# EAGLE design schem_interface_v2 (EAGLE 9.6.2)
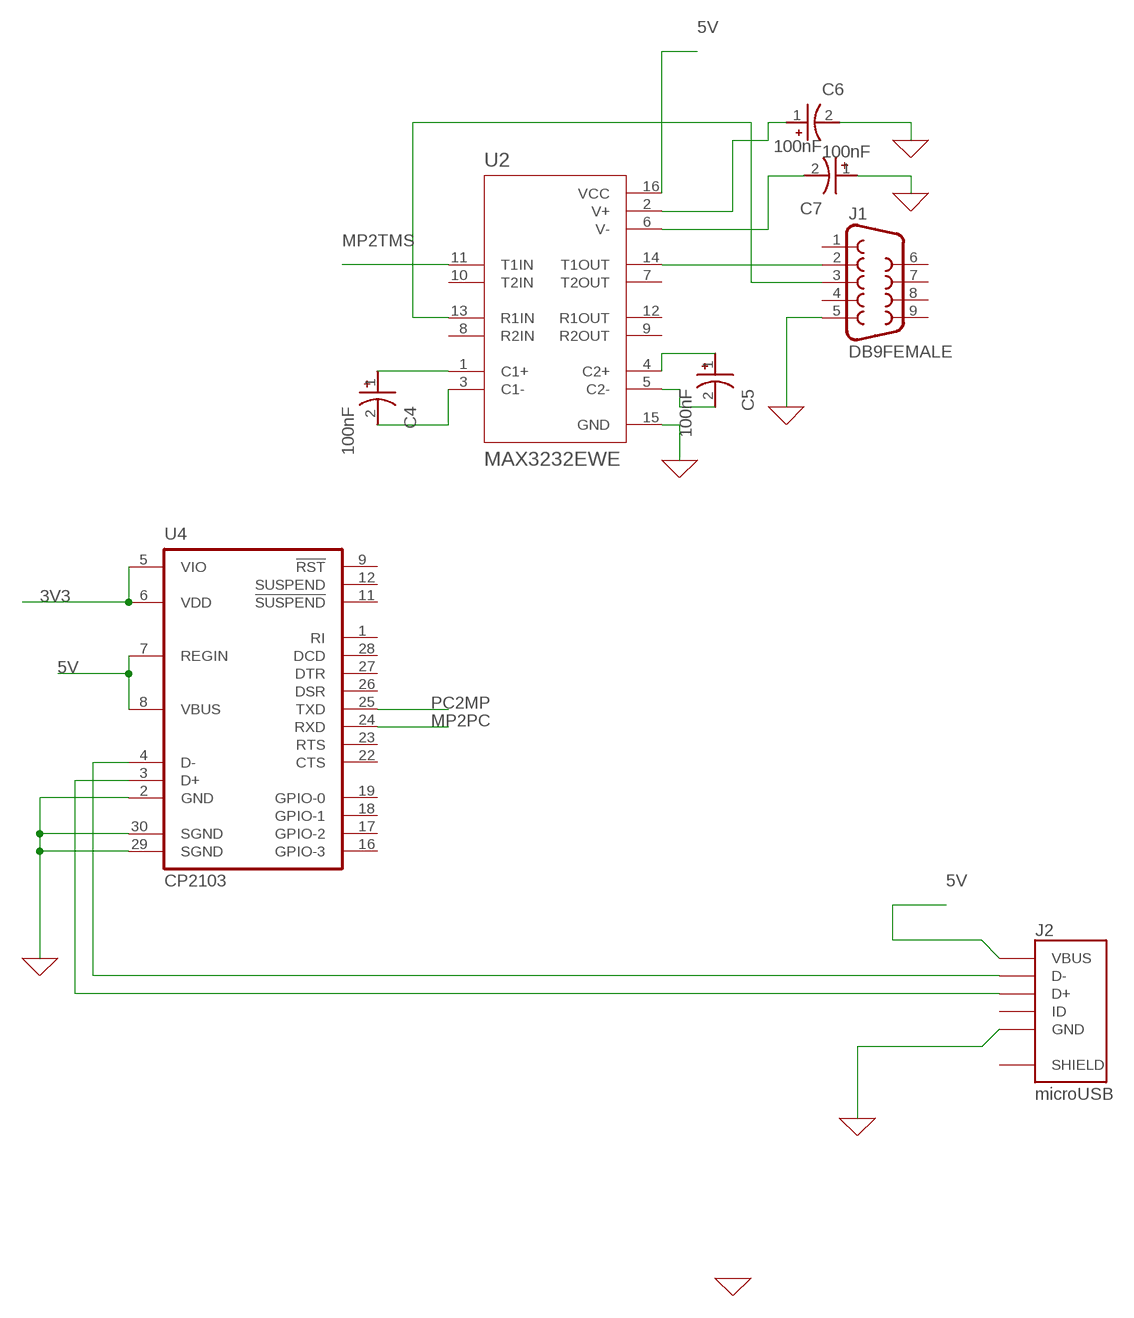
[diagram p0: schematic, sheet 1, part 1 of 2]
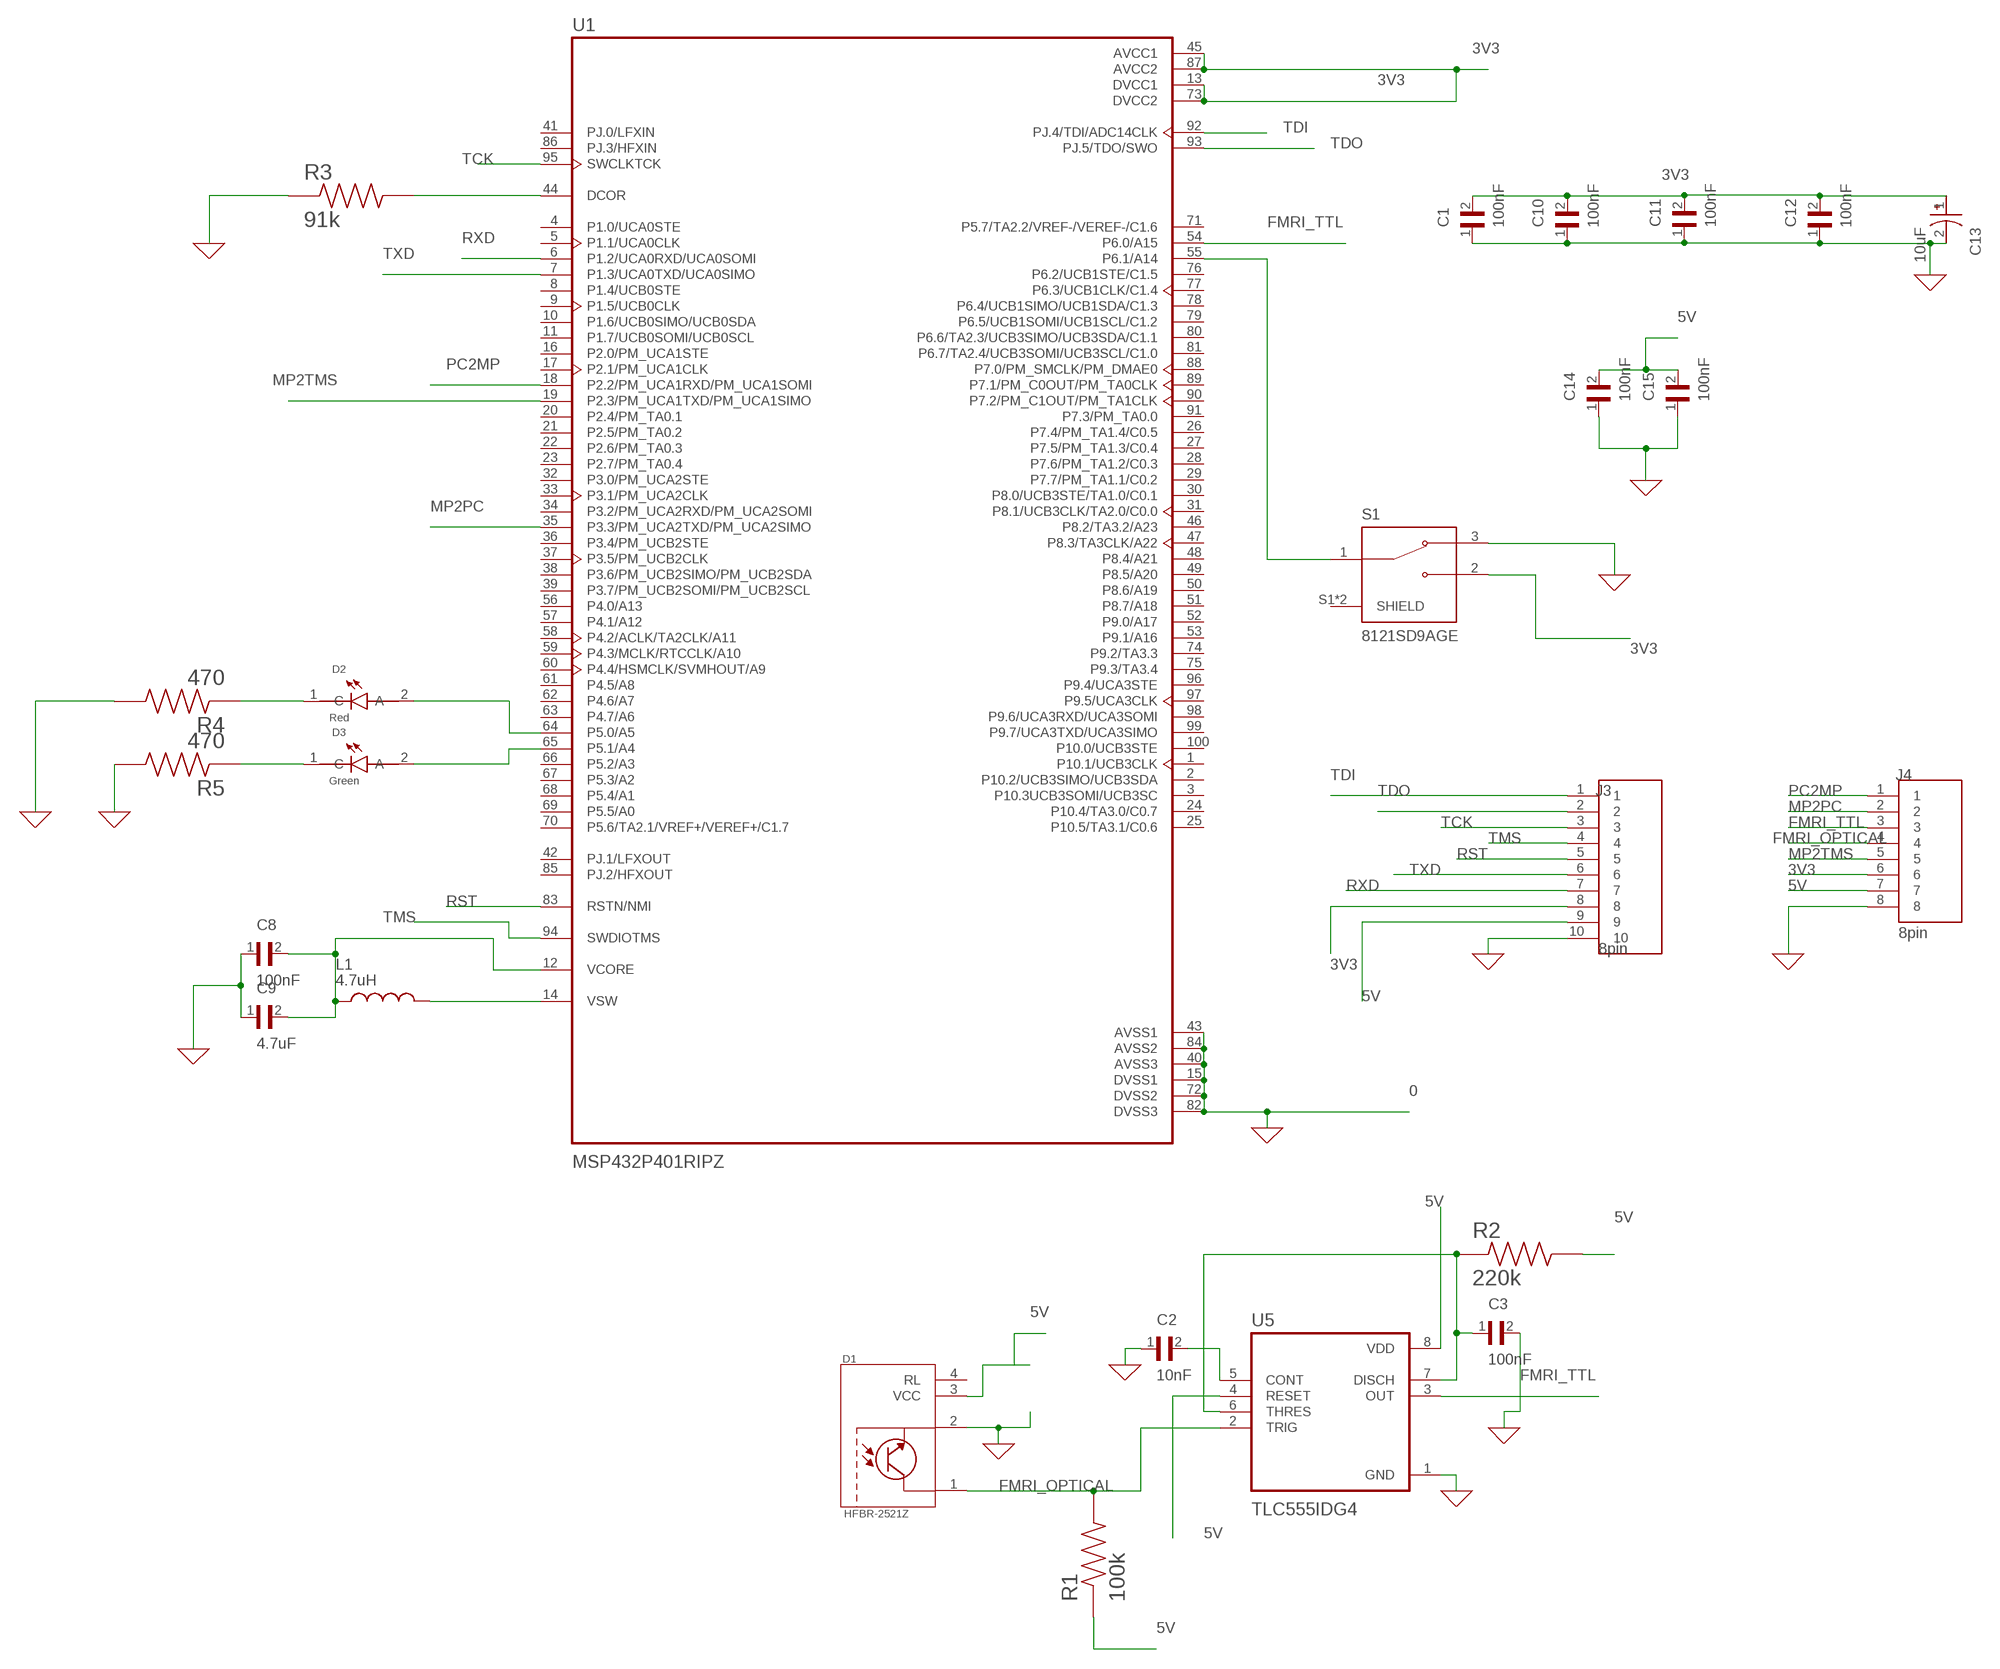
[diagram p1: schematic, sheet 1, part 2 of 2]

## Parts
C1  100nF  LD06ZC225KAB2A\500  [CAPC3216X178N]
C2  10nF  LD06ZC225KAB2A\500  [CAPC3216X178N]
C3  100nF  LD06ZC225KAB2A\500  [CAPC3216X178N]
C4  100nF  T491A106K020AT  [CAPMP3216X180N]
C5  100nF  T491A106K020AT  [CAPMP3216X180N]
C6  100nF  T491A106K020AT  [CAPMP3216X180N]
C7  100nF  T491A106K020AT  [CAPMP3216X180N]
C8  100nF  LD06ZC225KAB2A\500  [CAPC3216X178N]
C9  4.7uF  LD06ZC225KAB2A\500  [CAPC3216X178N]
C10  100nF  LD06ZC225KAB2A\500  [CAPC3216X178N]
C11  100nF  LD06ZC225KAB2A\500  [CAPC3216X178N]
C12  100nF  LD06ZC225KAB2A\500  [CAPC3216X178N]
C13  10uF  T491A106K020AT  [CAPMP3216X180N]
C14  100nF  LD06ZC225KAB2A\500  [CAPC3216X178N]
C15  100nF  LD06ZC225KAB2A\500  [CAPC3216X178N]
D1  HFBR-2521Z  [OPTO_HFBR-2521Z]
D2  Red  598-8210-107F  [LEDC3216X110N]
D3  Green  598-8210-107F  [LEDC3216X110N]
J1  DB9FEMALE  [DB9]
J2  microUSB  USB3090-XX-X_REVE  [GCT_USB3090-XX-X_REVE]
J3  8pin  4-644456-0  [TE_4-644456-0]
J4  8pin  5-146282-8  [TE_5-146282-8]
L1  4.7uH  LQM21PN4R7NGRD  [INDC2012X100N]
R1  100k  352015KJT  [RESC6432X70N]
R2  220k  352015KJT  [RESC6432X70N]
R3  91k  352015KJT  [RESC6432X70N]
R4  470  352015KJT  [RESC6432X70N]
R5  470  352015KJT  [RESC6432X70N]
S1  8121SD9AGE  [SW_8121SD9AGE]
U1  MSP432P401RIPZ  [QFP50P1600X1600X160-100N]
U2  MAX3232EWE  [SOIC127P1032X265-16N]
U4  CP2103  [QFN28]
U5  TLC555IDG4  [SOIC127P599X175-8N]

## Nets
0: C1.1 C2.1 C3.2 C6.2 C7.1 C8.1 C9.1 C10.1 C11.1 C12.1 C13.2 C14.1 C15.1 D1.2(GROUND) J1.5 J2.5(GND) J3.10 J4.8 R3.1 R4.2 R5.2 S1.3 U1.15(DVSS1) U1.40(AVSS3) U1.43(AVSS1) U1.72(DVSS2) U1.82(DVSS3) U1.84(AVSS2) U2.15(GND) U4.2(GND) U4.29(SGND) U4.30(SGND) U5.1(GND) ; supply symbol labelled GND
3V3: C1.2 C10.2 C11.2 C12.2 C13.1 J3.8 J4.6 S1.2 U1.13(DVCC1) U1.45(AVCC1) U1.73(DVCC2) U1.87(AVCC2) U4.5(VIO) U4.6(VDD)
5V: C14.2 C15.2 D1.3(VCC) J2.1(VBUS) J3.9 J4.7 R1.1 R2.2 U2.16(VCC) U4.7(REGIN) U4.8(VBUS) U5.4(RESET) U5.8(VDD)
FMRI_OPTICAL: D1.1(VO) J4.4 R1.2 U5.2(TRIG)
FMRI_TTL: J4.3 U1.54(P6.0/A15) U5.3(OUT)
MP2PC: J4.2 U1.35(P3.3/PM_UCA2TXD/PM_UCA2SIMO) U4.24(RXD)
MP2TMS: J4.5 U1.19(P2.3/PM_UCA1TXD/PM_UCA1SIMO) U2.11(T1IN)
N$1: D2.1(C) R4.1
N$2: C2.2 U5.5(CONT)
N$3: C3.1 R2.1 U5.6(THRES) U5.7(DISCH)
N$6: J1.2 U2.14(T1OUT)
N$7: C6.1 U2.2(V+)
N$8: J1.3 U2.13(R1IN)
N$9: C7.2 U2.6(V-)
N$10: R3.2 U1.44(DCOR)
N$11: D2.2(A) U1.64(P5.0/A5)
N$12: C5.1 U2.4(C2+)
N$13: C5.2 U2.5(C2-)
N$14: C4.1 U2.1(C1+)
N$15: C4.2 U2.3(C1-)
N$16: L1.2 U1.14(VSW)
N$17: C8.2 C9.2 L1.1 U1.12(VCORE)
N$18: D3.2(A) U1.65(P5.1/A4)
N$19: D3.1(C) R5.1
N$20: J2.3(D+) U4.3(D+)
N$21: S1.1 U1.55(P6.1/A14)
N$22: J2.2(D-) U4.4(D-)
PC2MP: J4.1 U1.18(P2.2/PM_UCA1RXD/PM_UCA1SOMI) U4.25(TXD)
RST: J3.5 U1.83(RSTN/NMI)
RXD: J3.7 U1.6(P1.2/UCA0RXD/UCA0SOMI)
TCK: J3.3 U1.95(SWCLKTCK)
TDI: J3.1 U1.92(PJ.4/TDI/ADC14CLK)
TDO: J3.2 U1.93(PJ.5/TDO/SWO)
TMS: J3.4 U1.94(SWDIOTMS)
TXD: J3.6 U1.7(P1.3/UCA0TXD/UCA0SIMO)
Unconnected: D1.4(RL) J1.1 J1.4 J1.6 J1.7 J1.8 J1.9 J2.4(ID) S1.S1(SHIELD) S1.S2(SHIELD) U1.1(P10.1/UCB3CLK) U1.2(P10.2/UCB3SIMO/UCB3SDA) U1.3(P10.3UCB3SOMI/UCB3SC) U1.4(P1.0/UCA0STE) U1.5(P1.1/UCA0CLK) U1.8(P1.4/UCB0STE) U1.9(P1.5/UCB0CLK) U1.10(P1.6/UCB0SIMO/UCB0SDA) U1.11(P1.7/UCB0SOMI/UCB0SCL) U1.16(P2.0/PM_UCA1STE) U1.17(P2.1/PM_UCA1CLK) U1.20(P2.4/PM_TA0.1) U1.21(P2.5/PM_TA0.2) U1.22(P2.6/PM_TA0.3) U1.23(P2.7/PM_TA0.4) U1.24(P10.4/TA3.0/C0.7) U1.25(P10.5/TA3.1/C0.6) U1.26(P7.4/PM_TA1.4/C0.5) U1.27(P7.5/PM_TA1.3/C0.4) U1.28(P7.6/PM_TA1.2/C0.3) U1.29(P7.7/PM_TA1.1/C0.2) U1.30(P8.0/UCB3STE/TA1.0/C0.1) U1.31(P8.1/UCB3CLK/TA2.0/C0.0) U1.32(P3.0/PM_UCA2STE) U1.33(P3.1/PM_UCA2CLK) U1.34(P3.2/PM_UCA2RXD/PM_UCA2SOMI) U1.36(P3.4/PM_UCB2STE) U1.37(P3.5/PM_UCB2CLK) U1.38(P3.6/PM_UCB2SIMO/PM_UCB2SDA) U1.39(P3.7/PM_UCB2SOMI/PM_UCB2SCL) U1.41(PJ.0/LFXIN) U1.42(PJ.1/LFXOUT) U1.46(P8.2/TA3.2/A23) U1.47(P8.3/TA3CLK/A22) U1.48(P8.4/A21) U1.49(P8.5/A20) U1.50(P8.6/A19) U1.51(P8.7/A18) U1.52(P9.0/A17) U1.53(P9.1/A16) U1.56(P4.0/A13) U1.57(P4.1/A12) U1.58(P4.2/ACLK/TA2CLK/A11) U1.59(P4.3/MCLK/RTCCLK/A10) U1.60(P4.4/HSMCLK/SVMHOUT/A9) U1.61(P4.5/A8) U1.62(P4.6/A7) U1.63(P4.7/A6) U1.66(P5.2/A3) U1.67(P5.3/A2) U1.68(P5.4/A1) U1.69(P5.5/A0) U1.70(P5.6/TA2.1/VREF+/VEREF+/C1.7) U1.71(P5.7/TA2.2/VREF-/VEREF-/C1.6) U1.74(P9.2/TA3.3) U1.75(P9.3/TA3.4) U1.76(P6.2/UCB1STE/C1.5) U1.77(P6.3/UCB1CLK/C1.4) U1.78(P6.4/UCB1SIMO/UCB1SDA/C1.3) U1.79(P6.5/UCB1SOMI/UCB1SCL/C1.2) U1.80(P6.6/TA2.3/UCB3SIMO/UCB3SDA/C1.1) U1.81(P6.7/TA2.4/UCB3SOMI/UCB3SCL/C1.0) U1.85(PJ.2/HFXOUT) U1.86(PJ.3/HFXIN) U1.88(P7.0/PM_SMCLK/PM_DMAE0) U1.89(P7.1/PM_C0OUT/PM_TA0CLK) U1.90(P7.2/PM_C1OUT/PM_TA1CLK) U1.91(P7.3/PM_TA0.0) U1.96(P9.4/UCA3STE) U1.97(P9.5/UCA3CLK) U1.98(P9.6/UCA3RXD/UCA3SOMI) U1.99(P9.7/UCA3TXD/UCA3SIMO) U1.100(P10.0/UCB3STE) U2.7(T2OUT) U2.8(R2IN) U2.9(R2OUT) U2.10(T2IN) U2.12(R1OUT) U4.1(RI) U4.9(!RST!) U4.11(!SUSPEND!) U4.12(SUSPEND) U4.16(GPIO-3) U4.17(GPIO-2) U4.18(GPIO-1) U4.19(GPIO-0) U4.22(CTS) U4.23(RTS) U4.26(DSR) U4.27(DTR) U4.28(DCD)

## Power pins joined to a net without a drawn wire
SHIELD: J2.6(SHIELD) J2.7(SHIELD) J2.8(SHIELD) J2.9(SHIELD)

## Library data of the parts
C1-C3 C8-C12 C14 C15 = LD06ZC225KAB2A_500:LD06ZC225KAB2A\500: Ceramic Capacitor Check prices <https://pricing.snapeda.com/parts/LD06ZC225KAB2A%280/AVX/view-part?ref=eda>; AVAILABILITY: In Stock; DESCRIPTION: Ceramic Capacitor; MF: AVX; MP: LD06ZC225KAB2A(0; PACKAGE: 1206 AVX; PRICE: None; PURCHASE-URL: https://pricing.snapeda.com/search/part/LD06ZC225KAB2A(0/?ref=eda
C4-C7 C13 = T491A106K020AT:T491A106K020AT: 4.7µF Molded Tantalum Capacitors 25V 1206 (3216 Metric) 6Ohm Check prices <https://pricing.snapeda.com/parts/T491A106K020AT/KEMET/view-part?ref=eda>; AVAILABILITY: In Stock; DESCRIPTION: 10 µF Molded Tantalum Capacitors 20 V 1206 (3216 Metric) 5Ohm; MF: KEMET; MP: T491A106K020AT; PACKAGE: SMD-2 KEMET; PRICE: None; PURCHASE-URL: https://pricing.snapeda.com/search/part/T491A106K020AT/?ref=eda
D1 = HFBR-2521Z:HFBR-2521Z: Fiber Optic Receiver 5MBd -43dBm 4.75V - 5.25V 10mA Check prices <https://pricing.snapeda.com/parts/HFBR-2521Z/Broadcom%20Limited/view-part?ref=eda>; AVAILABILITY: In Stock; DESCRIPTION: Fiber Optic Receiver 5MBd -43dBm 4.75V ~ 5.25V 10mA; MF: Broadcom Limited; MP: HFBR-2521Z; PACKAGE: None; PRICE: None; PURCHASE-URL: https://pricing.snapeda.com/search/part/HFBR-2521Z/?ref=eda
D2 D3 = 598-8210-107F:598-8210-107F: LED, 1206, RED; Bulb Size:1.6mm x 3.2mm; LED Colour:Red; Luminous Intensity:80mcd; Viewing Angle:140°; Forward Current If:20mA; Forward Voltage:2V; LED Mounting:SMD; Lens Shape:Rectangular; Wavelength Typ:640nm; Dominant Wavelength:635nm; Dominant Wavelength Typ:635nm; Forward Current If Max:20mA; Forward Voltage VF Max:2V; LED Type:Standard; Lens Style:Water Clear; Material:AllnGaP; Mounting Type:SMD; No. of Pins:2; Operating Temperature Range:-30°C to +85°C; Opto Case Style:1206; Package / Case:1206; Termination Type:SMD; Voltage Vf Typ:2V Check prices <https://pricing.snapeda.com/parts/598-8210-107F/Dialight/view-part?ref=eda>; AVAILABILITY: In Stock; DESCRIPTION: Red 635nm LED Indication - Discrete 2V 1206 (3216 Metric); MF: Dialight; MP: 598-8210-107F; PACKAGE: 1206 Dialight; PRICE: None; PURCHASE-URL: https://pricing.snapeda.com/search/part/598-8210-107F/?ref=eda
J1 = DB9:DB9: DB9 Connector Standard DB9 (D-Sub 9) serial connector. Can be used for CAN bus as well as RS485 and RS232. Footprint production proven. Spark Fun Electronics SKU : PRT-00429 Check prices <https://pricing.snapeda.com/parts/DB9/Tripp%20Lite/view-part?ref=eda>; AVAILABILITY: In Stock; DESCRIPTION: Surge Suppressors Lightning 340A; MF: Tripp Lite; MP: DB9; PACKAGE: None; PRICE: None; PURCHASE-URL: https://pricing.snapeda.com/search/part/DB9/?ref=eda
J2 = USB3090-XX-X_REVE:USB3090-XX-X_REVE: Micro USB Receptacle, Type AB, SMT, R/A, Bottom Mount, w/out Peg, w/outer shell stakes Check prices <https://pricing.snapeda.com/parts/USB3090-30-A/Global%20Connector%20Technology/view-part?ref=eda>; AVAILABILITY: In Stock; DESCRIPTION: USB - micro AB USB 2.0 Receptacle Connector 5 Position Surface Mount, Right Angle; Through Hole, 2.35mm profile, 5 Pins, Horizontal, Bottom mount; MF: Global Connector Technology; MP: USB3090-30-A; PACKAGE: None; PRICE: None; PURCHASE-URL: https://pricing.snapeda.com/search/part/USB3090-30-A/?ref=eda
J3 = 4-644456-0:4-644456-0: Check prices <https://pricing.snapeda.com/parts/4-644456-0/TE%20Connectivity/view-part?ref=eda>; AVAILABILITY: In Stock; COMMENT: 4-644456-0; DESCRIPTION: Connector Header Through Hole 10 position 0.100 (2.54mm); EU_ROHS_COMPLIANCE: Compliant; MF: TE Connectivity; MP: 4-644456-0; PACKAGE: None; PRICE: None; PURCHASE-URL: https://pricing.snapeda.com/search/part/4-644456-0/?ref=eda
J4 = 5-146282-8:5-146282-8: 37 MODII HDR SRST B/A .100CL Check prices <https://pricing.snapeda.com/parts/5-146282-8/TE%20Connectivity/view-part?ref=eda>; AVAILABILITY: In Stock; COMMENT: 5-146282-8; DESCRIPTION: Connector Header Through Hole 8 position 0.100 (2.54mm); EU_ROHS_COMPLIANCE: Compliant; MF: TE Connectivity; MP: 5-146282-8; PACKAGE: None; PRICE: None; PURCHASE-URL: https://pricing.snapeda.com/search/part/5-146282-8/?ref=eda
L1 = LQM21PN4R7NGRD:LQM21PN4R7NGRD: FIXED IND 4.7UH 800MA 288 MOHM Check prices <https://pricing.snapeda.com/parts/LQM21PN4R7NGRD/Murata%20Electronics/view-part?ref=eda>; AVAILABILITY: In Stock; DESCRIPTION: Inductor with Inductance: 4.7uH Tol. +/-30%, Package: 0805 (2012); MF: Murata Electronics; MP: LQM21PN4R7NGRD; PACKAGE: 2012 Murata; PRICE: None; PURCHASE-URL: https://pricing.snapeda.com/search/part/LQM21PN4R7NGRD/?ref=eda
R1-R5 = 352015KJT:352015KJT: Fixed Resistors Check prices <https://pricing.snapeda.com/parts/352015KJT/TE%20Connectivity/view-part?ref=eda>; AVAILABILITY: In Stock; COMMENT: 1622820-9; DESCRIPTION: Fixed Resistors; EU_ROHS_COMPLIANCE: Compliant; MF: TE Connectivity; MP: 352015KJT; PACKAGE: 2512; POWER_RATING: 1 W; PRICE: None; PURCHASE-URL: https://pricing.snapeda.com/search/part/352015KJT/?ref=eda; RESISTANCE: 15K; TOLERANCE: 5%; VOLTAGE_RATING: 200 V
S1 = 8121SD9AGE:8121SD9AGE: Pushbutton Switch SPDT Standard Through Hole, Right Angle Check prices <https://pricing.snapeda.com/parts/8121SD9AGE/C%26K%20Components/view-part?ref=eda>; AVAILABILITY: In Stock; DESCRIPTION: Pushbutton Switch SPDT Standard Through Hole, Right Angle; MF: C&K Components; MP: 8121SD9AGE; PACKAGE: None; PRICE: None; PURCHASE-URL: https://pricing.snapeda.com/search/part/8121SD9AGE/?ref=eda
U1 = MSP432P401RIPZ:MSP432P401RIPZ: Check prices <https://pricing.snapeda.com/parts/MSP432P401RIPZ/Texas%20Instruments/view-part?ref=eda>; AVAILABILITY: In Stock; DESCRIPTION: SimpleLink ultra-low-power 32-bit Arm Cortex-M4F MCU With Precision ADC, 256KB Flash and 64KB RAM 100-LQFP -40 to 85; MF: Texas Instruments; MP: MSP432P401RIPZ; PACKAGE: LQFP-100 Texas Instruments; PRICE: None; PURCHASE-URL: https://pricing.snapeda.com/search/part/MSP432P401RIPZ/?ref=eda
U2 = MAX3232EWE:MAX3232EWE: 2/2 Transceiver Full RS232 16-SOIC Check prices <https://pricing.snapeda.com/parts/MAX3232EWE%2B/Maxim%20Integrated/view-part?ref=eda>; AVAILABILITY: In Stock; DESCRIPTION: 2/2 Transceiver Full RS232 16-SOIC; MF: Maxim Integrated; MP: MAX3232EWE+; PACKAGE: SOIC-16 Maxim; PRICE: None; PURCHASE-URL: https://pricing.snapeda.com/search/part/MAX3232EWE+/?ref=eda
U4 = CP2103:CP2103: USB TO UART BRIDGE Check prices <https://pricing.snapeda.com/parts/CP2103/Silicon%20Labs/view-part?ref=eda>; AVAILABILITY: In Stock; DESCRIPTION: USB Bridge, USB to UART USB 2.0 UART Interface 28-QFN (5x5); MF: Silicon Labs; MP: CP2103; PACKAGE: QFN-28 Silicon Labs; PRICE: None; PURCHASE-URL: https://pricing.snapeda.com/search/part/CP2103/?ref=eda
U5 = TLC555IDG4:TLC555IDG4: Check prices <https://pricing.snapeda.com/parts/TLC555IDG4/Texas%20Instruments/view-part?ref=eda>; AVAILABILITY: In Stock; DESCRIPTION: 2.1-MHz, 250-A, Low-Power Timer 8-SOIC -40 to 85; MF: Texas Instruments; MP: TLC555IDG4; PACKAGE: SOIC-8 Texas Instruments; PRICE: None; PURCHASE-URL: https://pricing.snapeda.com/search/part/TLC555IDG4/?ref=eda

## Board
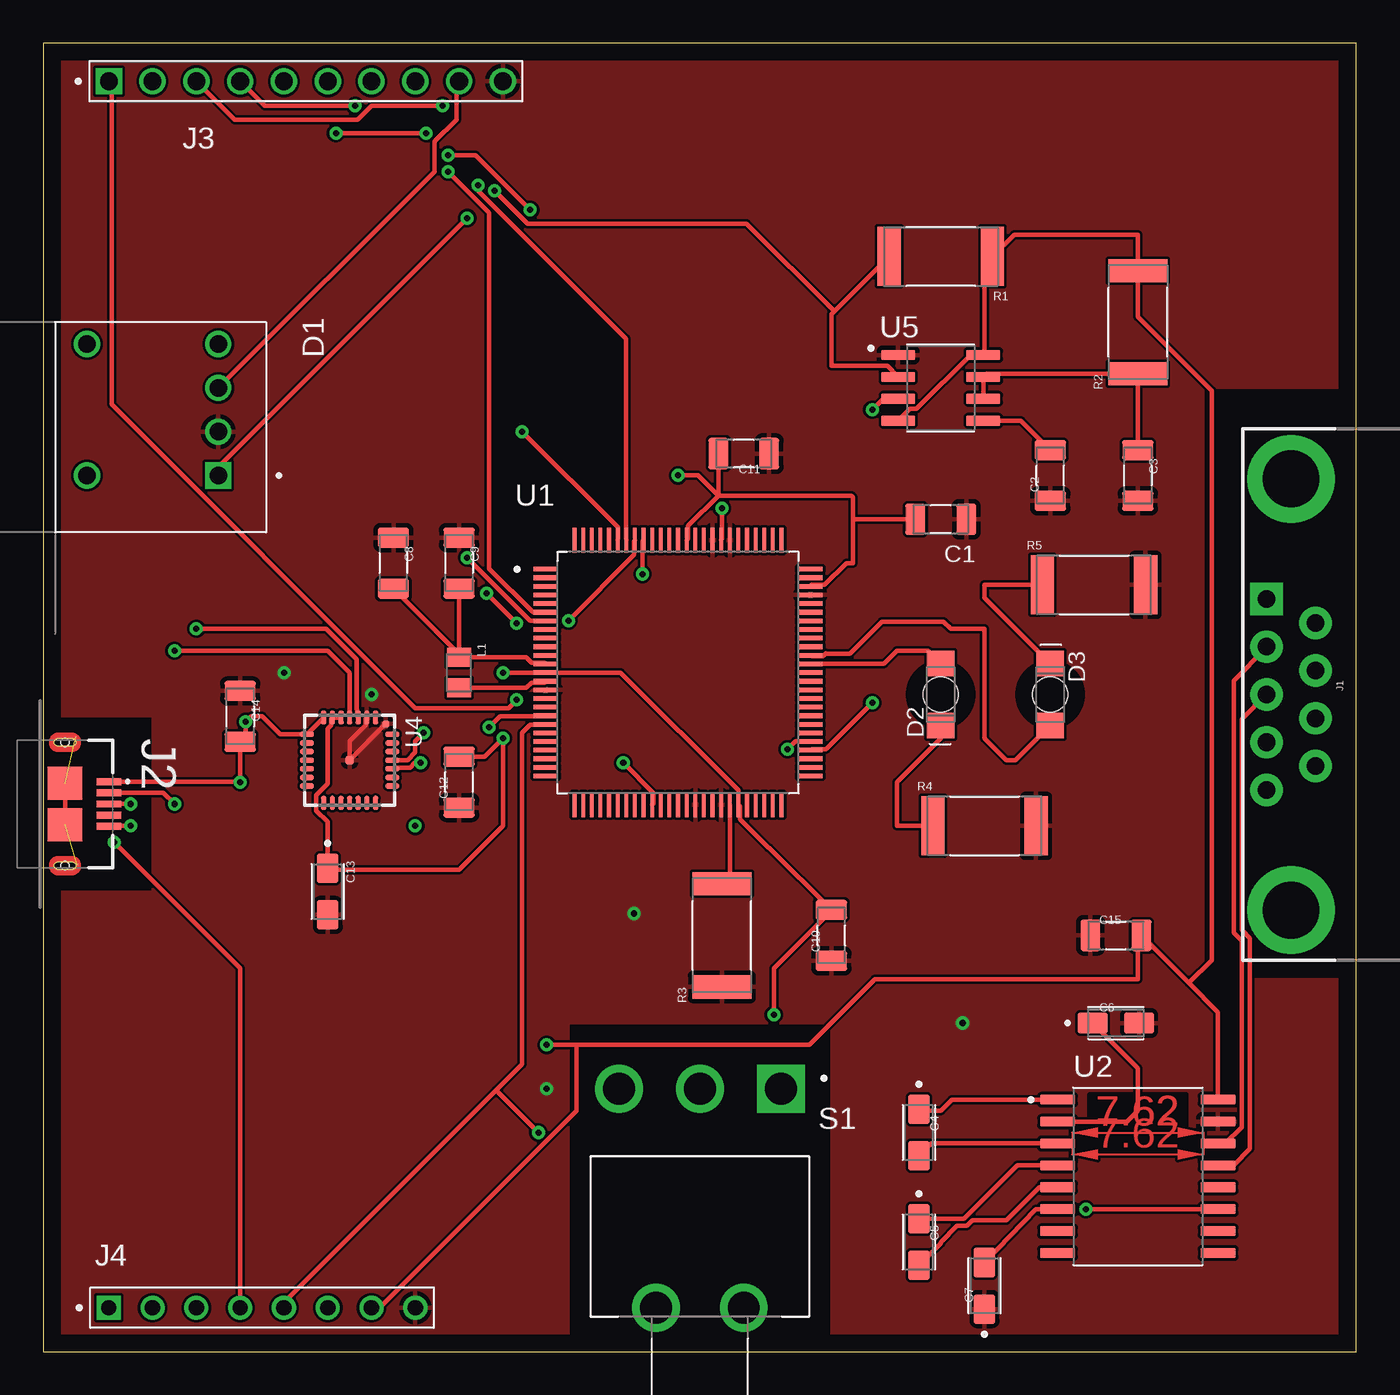
[diagram p2: board, top side]
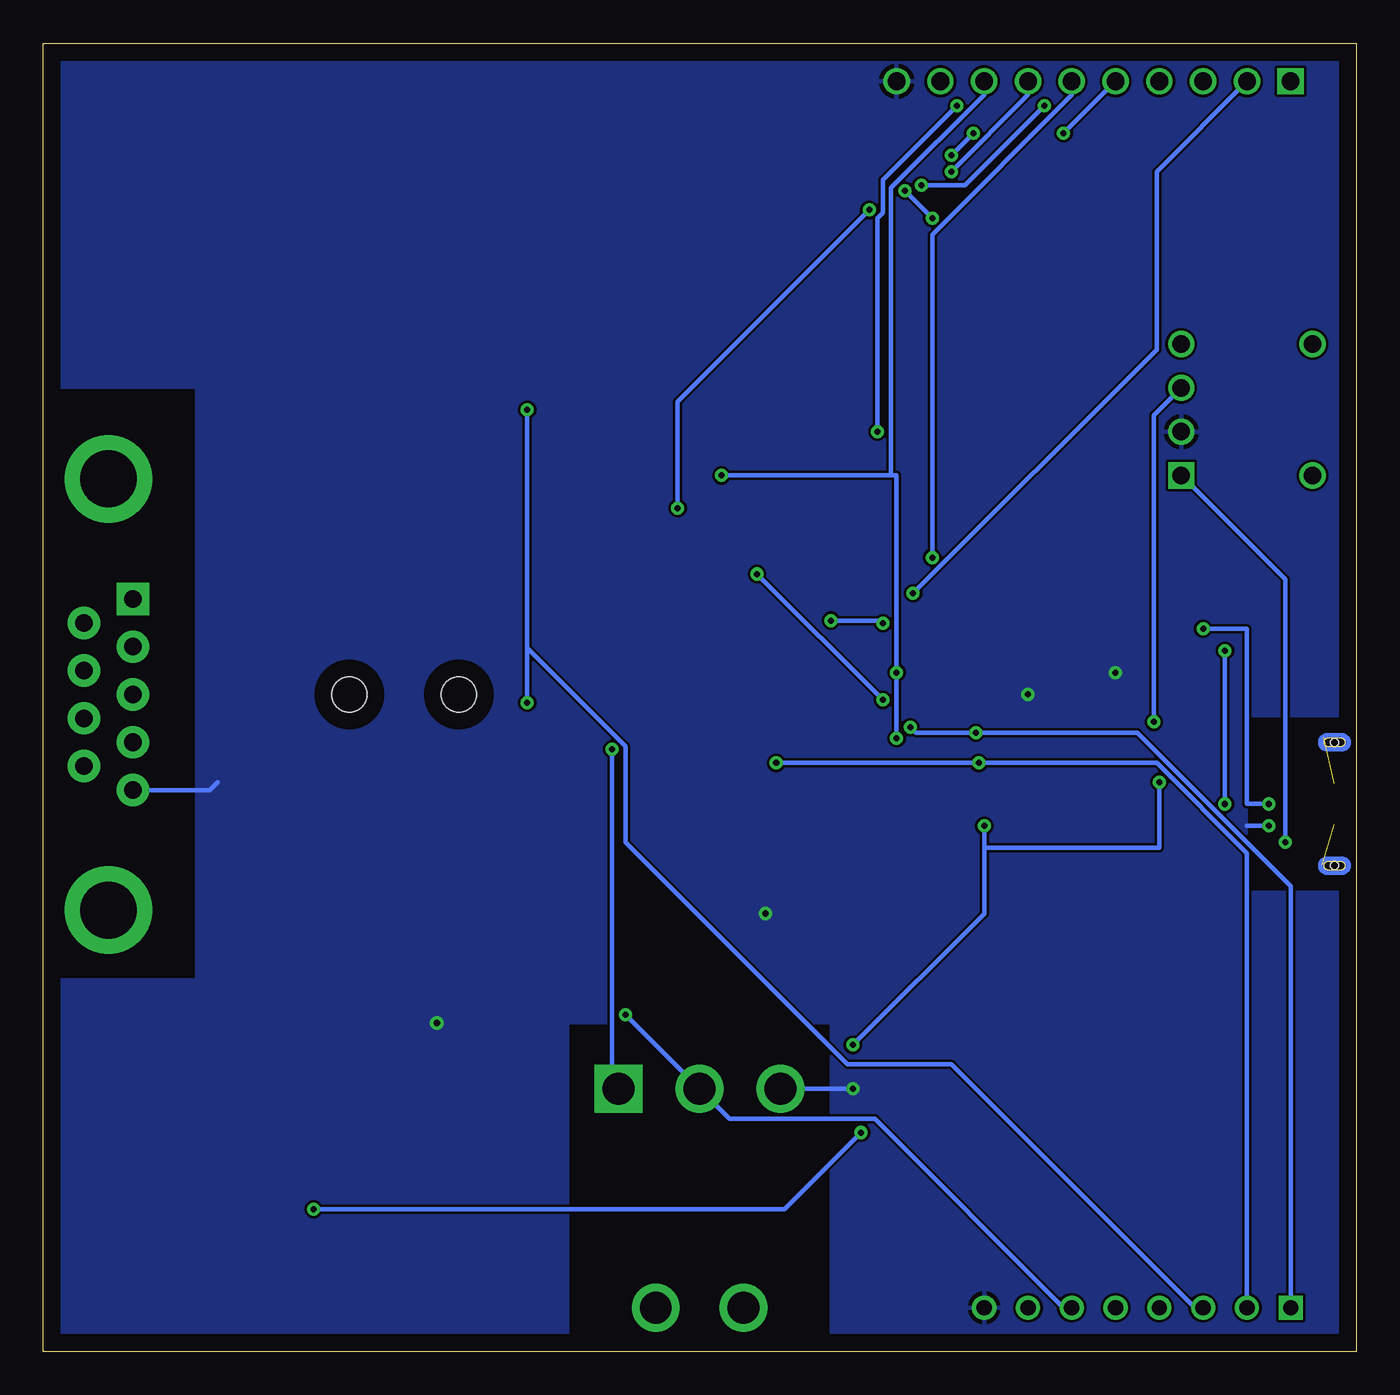
[diagram p3: board, bottom side, seen from below]

Size 76.18 x 75.87 mm. Coordinates in mm from the lower left corner, seen from the top.
Outline: 0,0 76.18,0 76.18,75.87 0,75.87 0,0
Copper layers (1*16): Top 0.035mm / dielectric 1.5mm / Bottom 0.035mm
Design rules "default *": minimum track width 10mil, minimum drill 0.35mm, track to track 6mil, track to pad 6mil, pad to pad 6mil, via to via 6mil, smd to smd 6mil, copper to edge 40mil, drill to drill 10mil, minimum pad ring 10mil, minimum via ring 8mil, stop-mask expansion 4mil, vias tented up to drill 0mil, thermal gap 10mil

### Footprints (pad centres in the part's own frame; a part is rotated, then mirrored left to right if it is on the bottom)
CAPC3216X178N = smd 1.16 x 1.82: 1 -1.475,0; 2 1.475,0
CAPMP3216X180N = smd 1.71 x 1.23: 1 -1.35,0; 2 1.35,0
OPTO_HFBR-2521Z = drill 1.01 square: 1 3.81,7.62 | drill 1.01: 2 1.27,7.62; 3 -1.27,7.62; 4 -3.81,7.62; 5 -3.81,0; 8 3.81,0
LEDC3216X110N = smd 1.5 x 1.59: 1 -1.795,0; 2 1.795,0 | hole 2: 0,0
DB9 = drill 1.016 pad 1.88 square: 1 -5.54,-1.42 | drill 1.016 pad 1.88: 2 -2.77,-1.42; 3 0,-1.42; 4 2.77,-1.42; 5 5.54,-1.42; 6 -4.15,1.42; 7 -1.38,1.42; 8 1.38,1.42; 9 4.15,1.42 | drill 3.302 pad 5.08: G1 -12.5,0; G2 12.5,0
GCT_USB3090-XX-X_REVE = smd 0.4 x 1.4: 1 -1.3,2.55; 2 -0.65,2.55; 3 0,2.55; 4 0.65,2.55; 5 1.3,2.55 | smd 0.1 x 0.1: 6 -3.87,0.63; 7 3.51,0.72 | smd 1.9 x 2: 8 -1.2,0; 9 1.2,0 | hole 0.45: -3.575,0; 3.575,0
TE_4-644456-0 = drill 1.02 pad 1.37 square: 1 0,0 | drill 1.02 pad 1.37: 2 2.54,0; 3 5.08,0; 4 7.62,0; 5 10.16,0; 6 12.7,0; 7 15.24,0; 8 17.78,0; 9 20.32,0; 10 22.86,0
TE_5-146282-8 = drill 0.89 pad 1.24 square: 1 0,0 | drill 0.89 pad 1.24: 2 2.54,0; 3 5.08,0; 4 7.62,0; 5 10.16,0; 6 12.7,0; 7 15.24,0; 8 17.78,0
INDC2012X100N = smd 1.1 x 1.42: 1 -0.885,0; 2 0.885,0
RESC6432X70N = smd 1.34 x 3.42: 1 -2.99,0; 2 2.99,0
SW_8121SD9AGE = drill 1.85 square: 1 4.7,12.7 | drill 1.85: 2 0,12.7; 3 -4.7,12.7; S1 2.54,0; S2 -2.54,0
QFP50P1600X1600X160-100N = smd 1.47 x 0.28: 1 -7.67,6; 2 -7.67,5.5; 3 -7.67,5; 4 -7.67,4.5; 5 -7.67,4; 6 -7.67,3.5; 7 -7.67,3; 8 -7.67,2.5; 9 -7.67,2; 10 -7.67,1.5; 11 -7.67,1; 12 -7.67,0.5; 13 -7.67,0; 14 -7.67,-0.5; 15 -7.67,-1; 16 -7.67,-1.5; 17 -7.67,-2; 18 -7.67,-2.5; 19 -7.67,-3; 20 -7.67,-3.5; 21 -7.67,-4; 22 -7.67,-4.5; 23 -7.67,-5; 24 -7.67,-5.5; 25 -7.67,-6; 51 7.67,-6; 52 7.67,-5.5; 53 7.67,-5; 54 7.67,-4.5; 55 7.67,-4; 56 7.67,-3.5; 57 7.67,-3; 58 7.67,-2.5; 59 7.67,-2; 60 7.67,-1.5; 61 7.67,-1; 62 7.67,-0.5; 63 7.67,0; 64 7.67,0.5; 65 7.67,1; 66 7.67,1.5; 67 7.67,2; 68 7.67,2.5; 69 7.67,3; 70 7.67,3.5; 71 7.67,4; 72 7.67,4.5; 73 7.67,5; 74 7.67,5.5; 75 7.67,6 | smd 0.28 x 1.47: 26 -6,-7.67; 27 -5.5,-7.67; 28 -5,-7.67; 29 -4.5,-7.67; 30 -4,-7.67; 31 -3.5,-7.67; 32 -3,-7.67; 33 -2.5,-7.67; 34 -2,-7.67; 35 -1.5,-7.67; 36 -1,-7.67; 37 -0.5,-7.67; 38 0,-7.67; 39 0.5,-7.67; 40 1,-7.67; 41 1.5,-7.67; 42 2,-7.67; 43 2.5,-7.67; 44 3,-7.67; 45 3.5,-7.67; 46 4,-7.67; 47 4.5,-7.67; 48 5,-7.67; 49 5.5,-7.67; 50 6,-7.67; 76 6,7.67; 77 5.5,7.67; 78 5,7.67; 79 4.5,7.67; 80 4,7.67; 81 3.5,7.67; 82 3,7.67; 83 2.5,7.67; 84 2,7.67; 85 1.5,7.67; 86 1,7.67; 87 0.5,7.67; 88 0,7.67; 89 -0.5,7.67; 90 -1,7.67; 91 -1.5,7.67; 92 -2,7.67; 93 -2.5,7.67; 94 -3,7.67; 95 -3.5,7.67; 96 -4,7.67; 97 -4.5,7.67; 98 -5,7.67; 99 -5.5,7.67; 100 -6,7.67
SOIC127P1032X265-16N = smd 2.05 x 0.59: 1 -4.655,4.445; 2 -4.655,3.175; 3 -4.655,1.905; 4 -4.655,0.635; 5 -4.655,-0.635; 6 -4.655,-1.905; 7 -4.655,-3.175; 8 -4.655,-4.445; 9 4.655,-4.445; 10 4.655,-3.175; 11 4.655,-1.905; 12 4.655,-0.635; 13 4.655,0.635; 14 4.655,1.905; 15 4.655,3.175; 16 4.655,4.445
QFN28 = smd 0.8 x 0.3: 1 -2.475,1.5; 2 -2.475,1; 3 -2.475,0.5; 4 -2.475,0; 5 -2.475,-0.5; 6 -2.475,-1; 7 -2.475,-1.5; 15 2.475,-1.5; 16 2.475,-1; 17 2.475,-0.5; 18 2.475,0; 19 2.475,0.5; 20 2.475,1; 21 2.475,1.5 | smd 0.3 x 0.8: 8 -1.5,-2.475; 9 -1,-2.475; 10 -0.5,-2.475; 11 0,-2.475; 12 0.5,-2.475; 13 1,-2.475; 14 1.5,-2.475; 22 1.5,2.475; 23 1,2.475; 24 0.5,2.475; 25 0,2.475; 26 -0.5,2.475; 27 -1,2.475; 28 -1.5,2.475 | smd 0.435 x 0.435: 29 -2.1,2.1 | smd 0.5 x 0.5: 30 0,0
SOIC127P599X175-8N = smd 1.97 x 0.6: 1 -2.47,1.905; 2 -2.47,0.635; 3 -2.47,-0.635; 4 -2.47,-1.905; 5 2.47,-1.905; 6 2.47,-0.635; 7 2.47,0.635; 8 2.47,1.905

### Placement (x,y rotation side)
C1  52.07,48.26 180 top
C2  58.42,50.8 90 top
C3  63.5,50.8 270 top
C4  50.8,12.7 270 top
C5  50.8,6.35 270 top
C6  62.23,19.05 0 top
C7  54.61,3.81 90 top
C8  20.32,45.72 270 top
C9  24.13,45.72 270 top
C10  45.72,24.13 90 top
C11  40.64,52.07 180 top
C12  24.13,33.02 90 top
C13  16.51,26.67 270 top
C14  11.43,36.83 270 top
C15  62.23,24.13 0 top
D1  2.54,54.61 270 top
D2  52.07,38.1 90 top
D3  58.42,38.1 270 top
J1  72.39,38.1 270 top
J2  1.27,31.75 270 top
J3  3.81,73.66 0 top
J4  3.81,2.54 0 top
L1  24.13,39.37 270 top
R1  52.07,63.5 180 top
R2  63.5,59.69 90 top
R3  39.37,24.13 90 top
R4  54.61,30.48 0 top
R5  60.96,44.45 0 top
S1  38.1,2.54 0 top
U1  36.83,39.37 0 top
U2  63.5,10.16 0 top
U4  17.78,34.29 270 top
U5  52.07,55.88 0 top

### Tracks (layer width: path | path; a pad name or v marks a point on that pad's centre or on a via)
0  (via drill 0.35)
  Top 0.254: J2.5 3.85,30.48 v5.08,30.48 | U4.29 U4.30 17.78,35.39 18.71,36.31 18.71,36.69 U4.2
  Bottom 0.254: J1.5 70.96,32.54 66.52,32.54 66.04,33.02 | S1.3 v29.21,15.24 | v5.08,30.48 6.35,30.48
  other vias: 53.34,19.05 34.29,25.4 13.97,39.37 19.05,38.1
  pour Top: 0,76.2 0,36.83 6.35,36.83 6.35,26.67 0,26.67 0,0 30.48,0 30.48,19.05 45.72,19.05 45.72,0 76.2,0 76.2,21.59 67.31,21.59 67.31,55.88 76.2,55.88 76.2,76.2
  pour Bottom: 0,76.2 0,36.83 6.35,36.83 6.35,26.67 0,26.67 0,0 30.48,0 30.48,19.05 45.72,19.05 45.72,0 76.2,0 76.2,21.59 67.31,21.59 67.31,55.88 76.2,55.88 76.2,76.2
3V3  (via drill 0.35)
  Top 0.254: C12.2 25.61,34.49 v26.67,35.56 26.67,30.48 24.13,27.94 16.59,27.94 C13.1 16.51,30.71 15.85,31.36 15.85,32.27 16.51,32.92 16.51,36.12 16.71,36.31 16.71,36.69 U4.6 U4.5 | v26.67,39.37 U1.13 33.5,39.37 40.32,32.54 40.32,31.75 U1.45 40.41,31.62 40.41,30.87 42.07,29.21 42.12,29.21 C10.2 45.72,25.56 42.39,22.23 v42.39,19.53 | U1.87 37.41,47.12 37.41,47.87 39.16,49.62 | C11.2 39.16,49.62 | U1.73 44.58,44.45 45.33,44.45 46.6,45.72 46.99,45.72 46.99,48.26 | 46.99,48.26 46.99,49.53 46.9,49.62 39.16,49.62 | v36.83,50.8 37.99,50.8 39.16,49.62 | C1.2 46.99,48.26
  Bottom 0.254: v26.67,35.56 v26.67,39.37 26.67,50.8 26.99,50.8 | 26.99,50.8 v36.83,50.8 | J4.6 16.99,2.54 27.94,13.49 36.35,13.49 S1.2 v42.39,19.53 | J3.8 21.59,72.87 26.99,67.47 26.99,50.8
5V  (via drill 0.35)
  Top 0.254: J2.1 11.4,33.05 v11.43,33.02 C14.2 11.43,35.4 11.75,35.72 v11.75,36.51 12.06,36.83 12.7,36.83 13.74,35.79 U4.8 U4.7 | U5.4 50.29,54.67 50.66,54.67 53.78,57.78 U5.8 54.61,57.78 54.61,63.18 54.93,63.5 R1.1 56.33,64.77 63.5,64.77 R2.2 63.5,60.01 67.79,55.72 67.79,22.7 66.46,21.38 | 66.46,21.38 C15.2 63.5,23.93 63.5,21.59 48.26,21.59 44.45,17.78 30.96,17.78 | 66.46,21.38 68.16,19.68 U2.16 | 30.96,17.78 v29.21,17.78 | D1.3 22.7,68.42 22.7,70.17 23.97,71.44 23.97,73.5 J3.9 | 30.96,17.78 30.96,13.97 19.53,2.54 J4.7
  Bottom 0.254: v29.21,17.78 21.59,25.4 21.59,29.21 | 21.59,29.21 v21.59,30.48 | D1.3 11.75,54.29 v11.75,36.51 | v11.43,33.02 11.43,29.21 21.59,29.21
FMRI_OPTICAL  (via drill 0.35)
  Top 0.254: R1.2 45.89,60.31 | 45.89,60.31 45.72,60.14 45.72,57.15 48.97,57.15 U5.2 | J4.4 11.43,22.23 v4.13,29.53 | 45.89,60.31 40.8,65.41 28.1,65.41 v26.19,67.31 | v24.61,65.72 10.16,51.28 D1.1
  Bottom 0.254: v4.13,29.53 4.13,44.77 D1.1 | v24.61,65.72 v26.19,67.31
FMRI_TTL  (via drill 0.35)
  Top 0.254: v48.1,37.62 45.4,34.92 44.61,34.92 U1.54 | v48.1,54.61 48.74,55.24 U5.3
  Bottom 0.254: v48.1,54.61 48.1,40.8 | 48.1,40.8 v48.1,37.62 | J4.3 9.37,2.54 23.5,16.67 29.53,16.67 42.39,29.53 42.39,35.08 48.1,40.8
MP2PC  (via drill 0.35)
  Top 0.254: v33.66,34.13 35.4,32.38 35.4,31.75 U1.35 | v21.91,34.13 21.55,34.13 21.28,33.86 20.33,33.86 U4.24
  Bottom 0.254: v33.66,34.13 v21.91,34.13 11.59,34.13 6.35,28.89 J4.2
MP2TMS  (via drill 0.35)
  Top 0.254: 26.27,15.16 13.97,2.86 J4.5 | 26.27,15.16 27.78,16.67 27.78,35.88 28.26,36.35 29.05,36.35 U1.19 | v60.48,8.26 U2.11 | 26.27,15.16 v28.73,12.7
  Bottom 0.254: v60.48,8.26 33.18,8.26 v28.73,12.7
N$1
  Top 0.254: D2.1 52.07,35.56 49.53,33.02 49.53,30.48 R4.1
N$2
  Top 0.254: U5.5 56.72,53.98 C2.2
N$3
  Top 0.254: U5.6 U5.7 54.73,56.7 R2.1 C3.1
N$6
  Top 0.254: U2.14 68.58,12.06 69.53,13.02 69.53,23.81 69.06,24.29 69.06,38.89 70.96,40.8 J1.2
N$7
  Top 0.254: U2.2 62.87,13.34 63.5,13.97 63.5,16.43 C6.1
N$8
  Top 0.254: U2.13 69.06,10.79 70.01,11.75 70.01,23.97 69.53,24.45 69.53,36.67 J1.3
N$9
  Top 0.254: C7.2 57.58,8.26 U2.6
N$10
  Top 0.254: R3.2 39.37,26.99 39.53,26.99 39.61,26.91 39.83,27.13 U1.44
N$11
  Top 0.254: U1.64 48.76,39.87 49.53,40.64 51.33,40.64 D2.2
N$12
  Top 0.254: C5.1 53.42,7.7 56.52,10.79 U2.4
N$13
  Top 0.254: C5.2 52.07,6.27 52.07,6.35 53.01,7.29 53.59,7.29 53.91,7.62 55.88,7.62 57.78,9.53 U2.5
N$14
  Top 0.254: U2.1 52.7,14.61 52.07,13.97 50.88,13.97 C4.1
N$15
  Top 0.254: C4.2 51.52,12.06 U2.3
N$16
  Top 0.254: U1.14 29.08,38.79 28.33,38.79 28.02,38.48 L1.2
N$17
  Top 0.254: C9.2 24.13,40.64 | 24.13,40.64 L1.1 28.02,40.26 28.33,39.95 29.08,39.95 U1.12 | C8.2 23.93,40.64 24.13,40.64
N$18
  Top 0.254: D3.2 56.41,34.29 55.88,34.29 54.61,35.56 54.61,41.91 52.65,41.91 52.24,42.32 48.67,42.32 46.8,40.45 45.4,40.45 45.4,40.48 45.24,40.32 44.61,40.32 U1.65
N$19
  Top 0.254: D3.1 54.61,43.7 54.61,44.45 R5.1
N$20  (via drill 0.35)
  Top 0.254: J2.3 v5.08,31.75 | v8.89,41.91 16.41,41.91 18.19,40.13 18.19,37.24 18.21,37.22 18.21,36.84 U4.3
  Bottom 0.254: v5.08,31.75 6.35,31.75 6.35,41.91 v8.89,41.91
N$21  (via drill 0.35)
  Top 0.254: v43.18,34.92 43.66,35.4 44.45,35.4 U1.55
  Bottom 0.254: v43.18,34.92 43.18,15.56 42.86,15.24 S1.1
N$22  (via drill 0.35)
  Top 0.254: J2.2 6.97,32.4 v7.62,31.75 | v7.62,40.64 16.51,40.64 17.78,39.37 U4.4
  Bottom 0.254: v7.62,31.75 v7.62,40.64
PC2MP  (via drill 0.35)
  Top 0.254: v25.88,36.2 26.51,36.83 29.05,36.83 U1.18 | v22.07,35.88 21.59,35.4 21.59,34.74 21.14,34.29 U4.25
  Bottom 0.254: J4.1 3.81,26.99 12.7,35.88 v22.07,35.88 22.86,35.88 25.56,35.88 v25.88,36.2
RST  (via drill 0.35)
  Top 0.254: v39.37,48.9 39.37,47.15 U1.83 | v28.26,66.2 25.08,69.37 v23.5,69.37 | v16.99,70.64 v22.23,70.64
  Bottom 0.254: v39.37,48.9 39.37,55.09 v28.26,66.2 | v22.23,70.64 v23.5,69.37 | J3.5 v16.99,70.64
RXD  (via drill 0.35)
  Top 0.254: v23.5,68.42 25.88,66.04 25.88,45.4 28.42,42.86 29.05,42.86 U1.6
  Bottom 0.254: v23.5,68.42 19.05,72.87 J3.7
SHIELD  (2 unrouted)
  Top 0.254: J2.8 J2.9
TCK  (via drill 0.35)
  Top 0.254: v27.78,53.34 33.34,47.78 33.34,47.15 U1.95 | v23.18,72.23 19.05,72.23 18.26,71.44 11.11,71.44 J3.3
  Bottom 0.254: v27.78,53.34 27.78,65.72 27.46,66.04 27.46,67.94 v23.18,72.23
TDI  (via drill 0.35)
  Top 0.254: v34.77,45.09 34.77,46.99 U1.92 | v27.46,37.78 26.99,37.31 21.59,37.31 3.97,54.93 3.97,73.5 J3.1
  Bottom 0.254: v27.46,37.78 v34.77,45.09
TDO  (via drill 0.35)
  Top 0.254: v30.48,42.39 34.29,46.2 34.29,46.99 U1.93 | v25.72,43.97 v27.46,42.23
  Bottom 0.254: v30.48,42.39 27.62,42.39 v27.46,42.23 | v25.72,43.97 11.59,58.1 11.59,68.42 J3.2
TMS  (via drill 0.35)
  Top 0.254: v25.24,67.63 25.24,67.31 33.81,58.74 33.81,47.15 U1.94 | v18.1,72.23 12.86,72.23 J3.4
  Bottom 0.254: v25.24,67.63 22.7,67.63 v18.1,72.23
TXD  (via drill 0.35)
  Top 0.254: v24.61,46.04 28.26,42.39 29.05,42.39 U1.7
  Bottom 0.254: v24.61,46.04 24.61,64.77 16.51,72.87 J3.6
(copper drawn outside any net)
  shapes: Top area x3